# Altium schematic sheet Arduino_DUE_Magic_Pen.SchDoc
size C
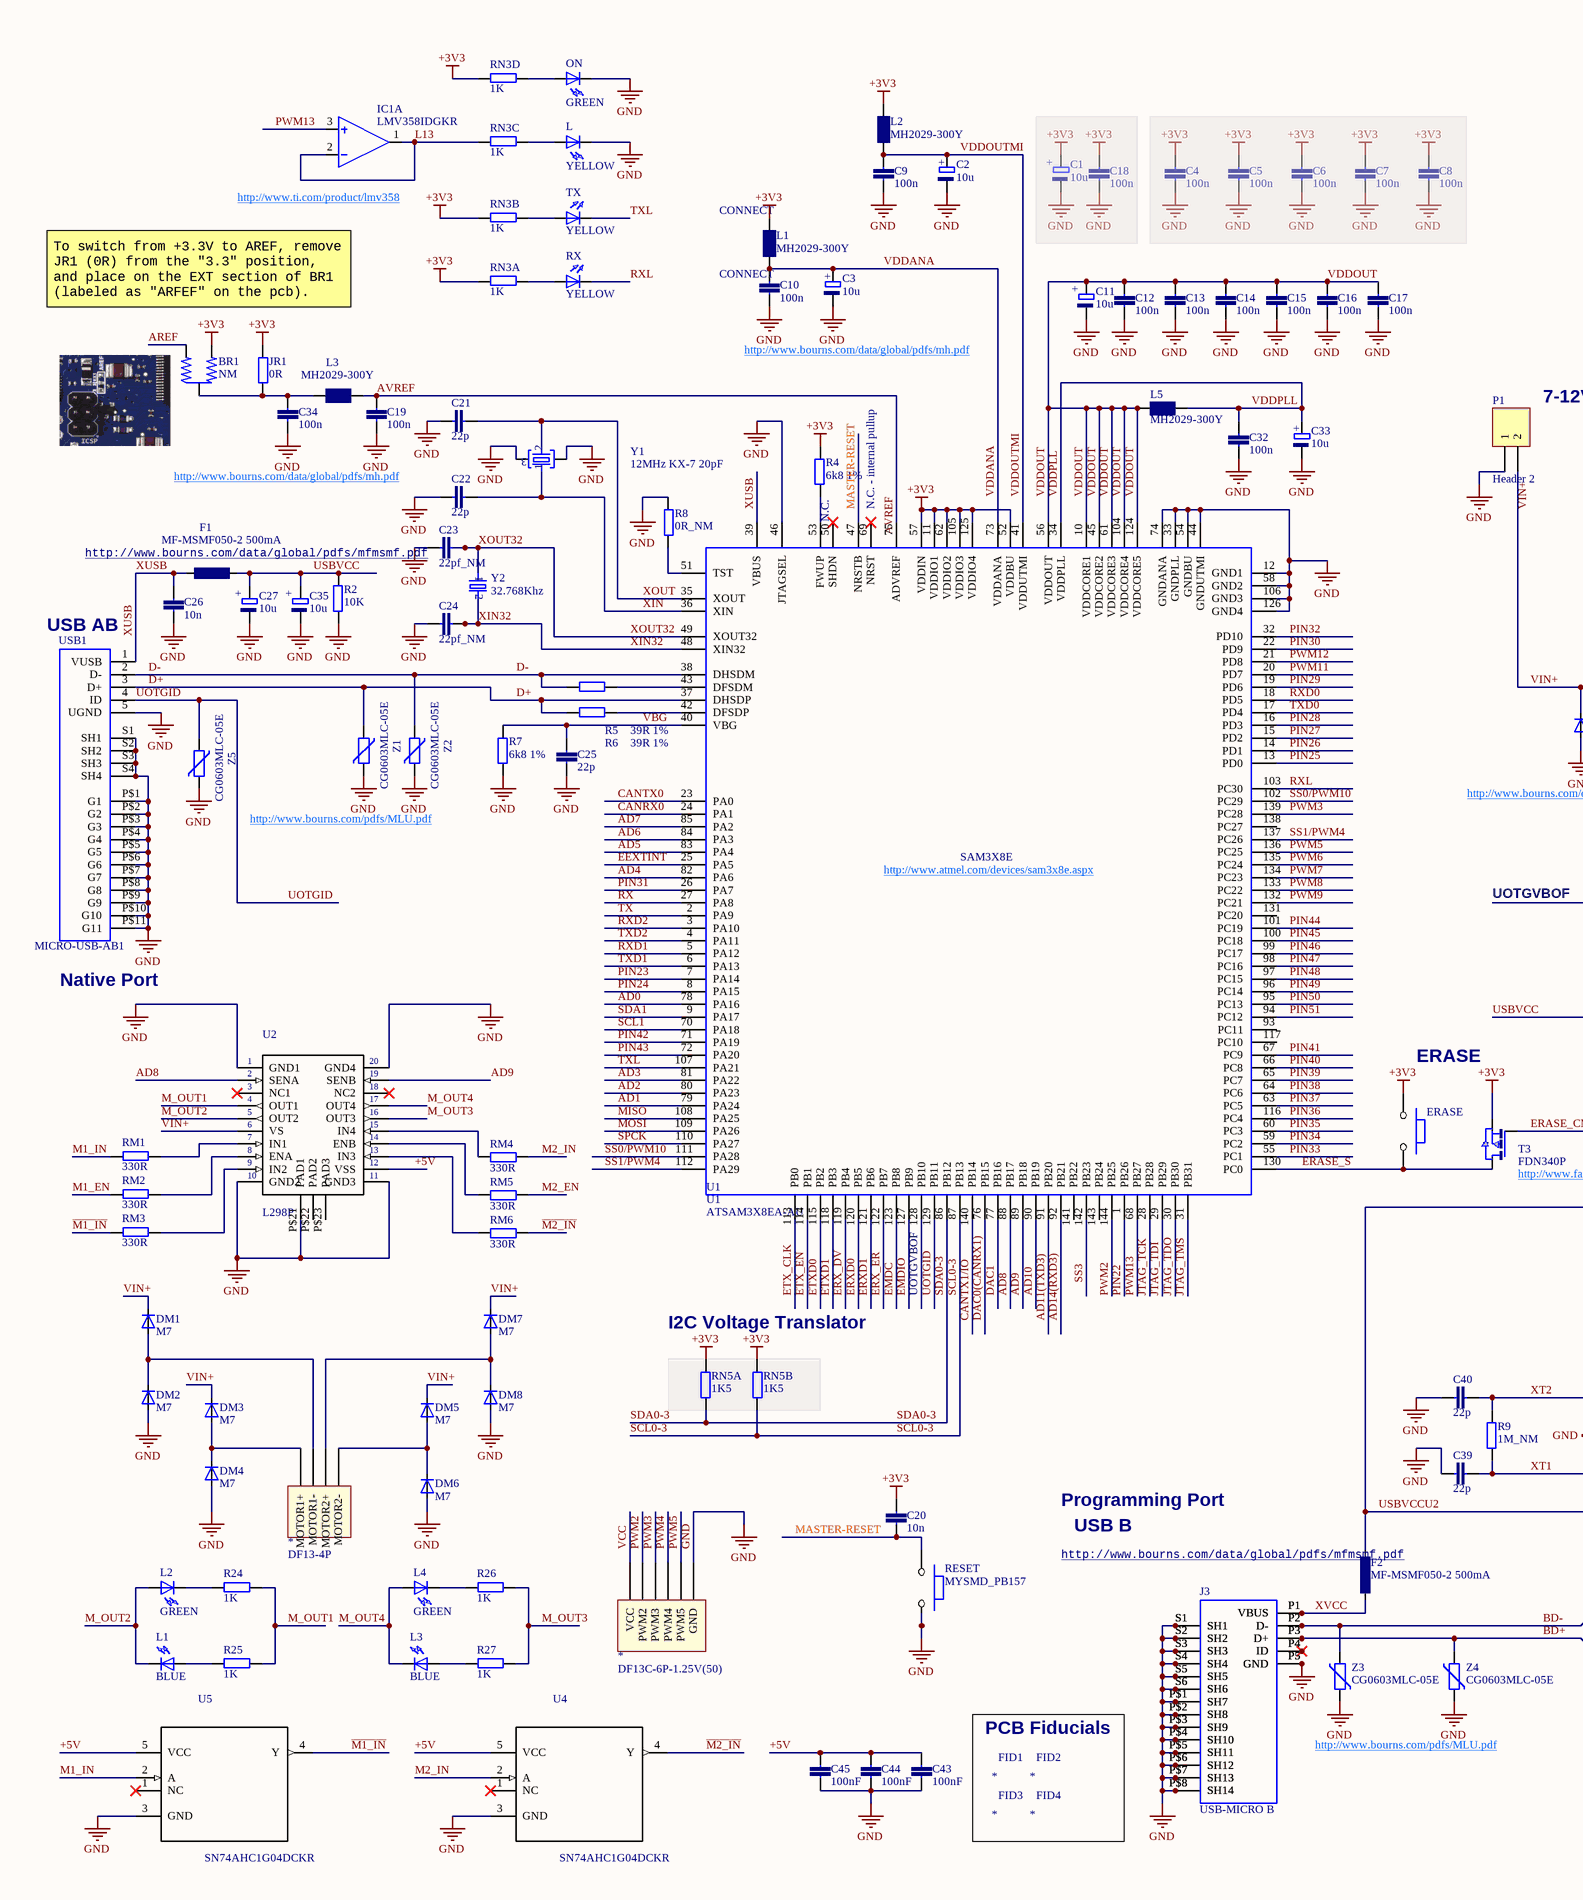
[diagram p0: Arduino_DUE_Magic_Pen.SchDoc, left]
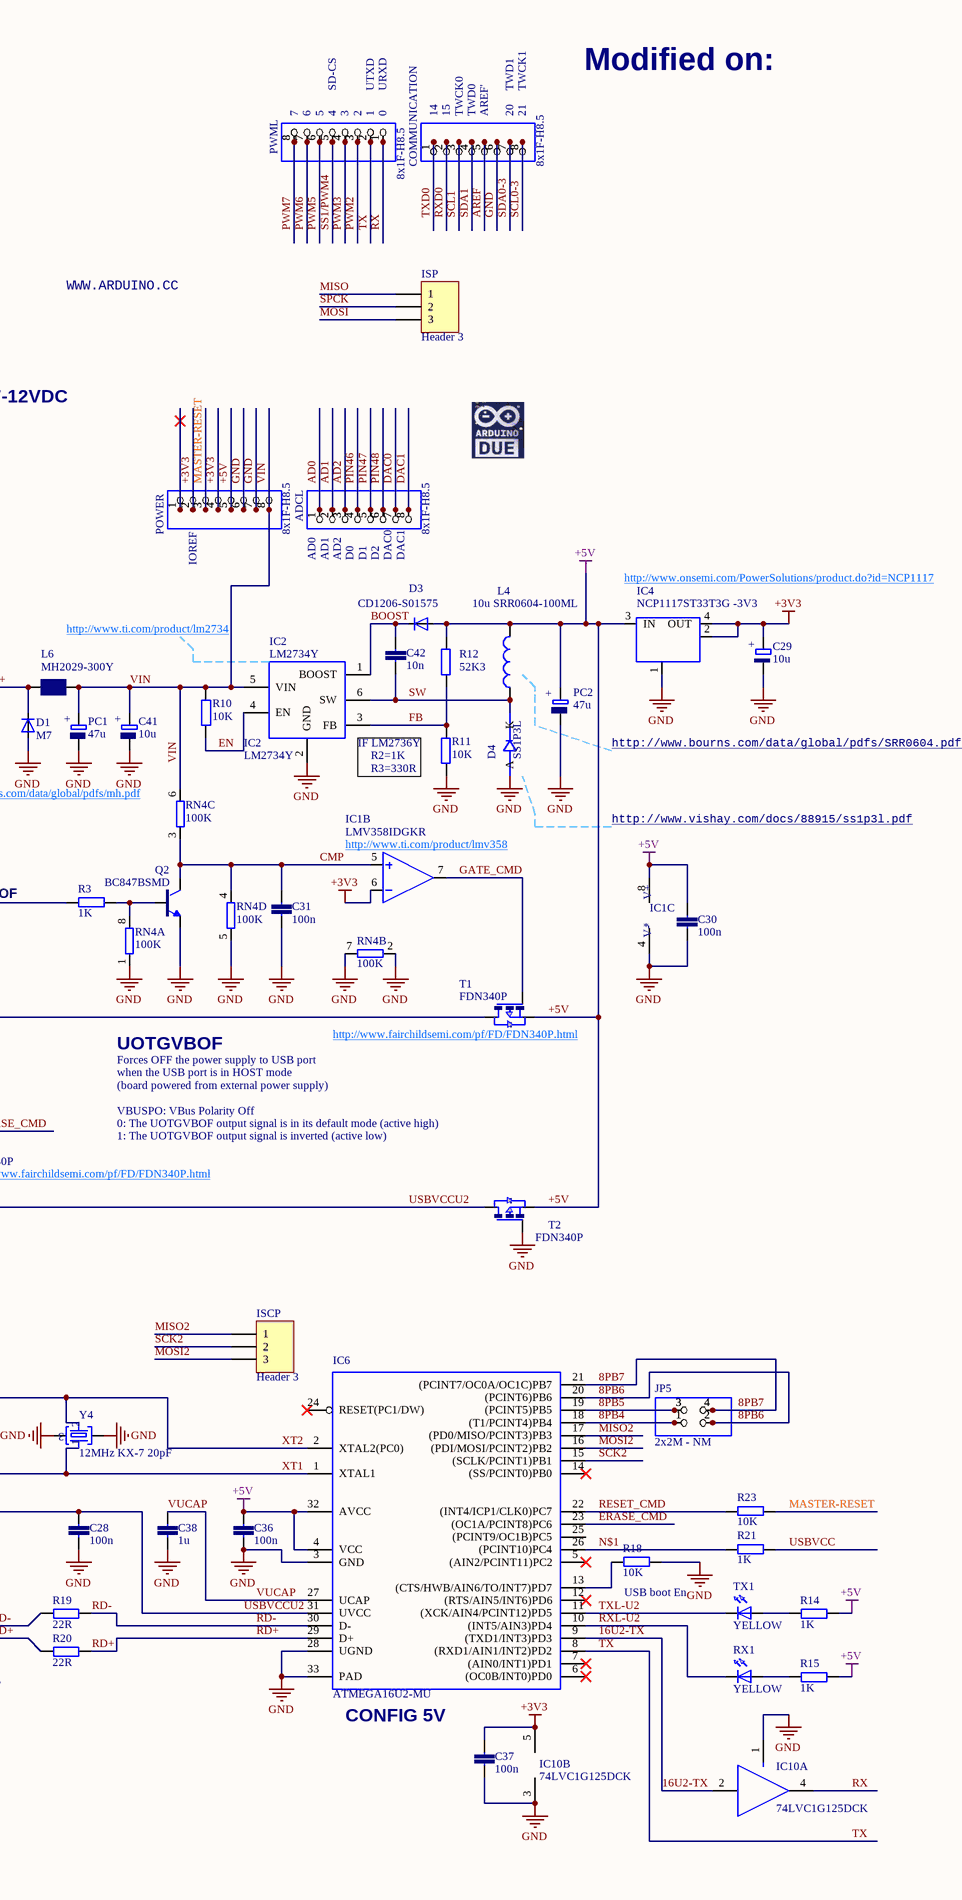
[diagram p1: Arduino_DUE_Magic_Pen.SchDoc, right]

## Parts
(Parts that share a designator on the sheet are numbered #1, #2 ... from top to bottom, then left to right.)
*#1  DF13-4P  [DF13C4P]
*#2  DF13C-6P-1.25V(50)  [DF13C6P]
ADCL  8x1F-H8.5  [1X08]
BR1  NM  [J0402]
C1  10u  [SMC_B]
C2  10u  [SMC_B]
C3  10u  [SMC_B]
C4  100n  [C0603-ROUND]
C5  100n  [C0603-ROUND]
C6  100n  [C0603-ROUND]
C7  100n  [C0603-ROUND]
C8  100n  [C0603-ROUND]
C9  100n  [C0603-ROUND]
C10  100n  [C0603-ROUND]
C11  10u  [SMC_B]
C12  100n  [C0603-ROUND]
C13  100n  [C0603-ROUND]
C14  100n  [C0603-ROUND]
C15  100n  [C0603-ROUND]
C16  100n  [C0603-ROUND]
C17  100n  [C0603-ROUND]
C18  100n  [C0603-ROUND]
C19  100n  [C0603-ROUND]
C20  10n  [C0603-ROUND]
C21  22p  [C0603-ROUND]
C22  22p  [C0603-ROUND]
C23  22pf_NM  [C0603-ROUND]
C24  22pf_NM  [C0603-ROUND]
C25  22p  [C0603-ROUND]
C26  10n  [C0603-ROUND]
C27  10u  [SMC_B]
C28  100n  [C0603-ROUND]
C29  10u  [SMC_B]
C30  100n  [C0603-ROUND]
C31  100n  [C0603-ROUND]
C32  100n  [C0603-ROUND]
C33  10u  [SMC_B]
C34  100n  [C0603-ROUND]
C35  10u  [SMC_B]
C36  100n  [C0603-ROUND]
C37  100n  [C0603-ROUND]
C38  1u  [C0603-ROUND]
C39  22p  [C0603-ROUND]
C40  22p  [C0603-ROUND]
C41  10u  [SMC_B]
C42  10n  [C0603-ROUND]
C43  100nF  [C0603-ROUND]
C44  100nF  [C0603-ROUND]
C45  100nF  [C0603-ROUND]
COMMUNICATION  8x1F-H8.5  [1X08]
D1  M7  [SMB]
D3  CD1206-S01575  [MINIMELF]
D4  SS1P3L  [DO220AAL]  (value not drawn)
DM1  M7  [0603]
DM2  M7  [0603]
DM3  M7  [0603]
DM4  M7  [0603]
DM5  M7  [0603]
DM6  M7  [0603]
DM7  M7  [0603]
DM8  M7  [0603]
ERASE  (no value)  [SMD_157SW]
F1  MF-MSMF050-2 500mA  [L1812]
F2  MF-MSMF050-2 500mA  [L1812]
FID1  *  [FIDUCIA-MOUNT]
FID2  *  [FIDUCIA-MOUNT]
FID3  *  [FIDUCIA-MOUNT]
FID4  *  [FIDUCIA-MOUNT]
IC1  LMV358IDGKR  [MSOP08]  (parts A,B,C of 3)
IC2  LM2734Y  [SOT23-6]
IC4  NCP1117ST33T3G -3V3  [SOT223]
IC6  ATMEGA16U2-MU  [MLF32]
IC10  74LVC1G125DCK  [SC70-5]  (parts A,B of 2)
ISCP  Header 3  [HDR1X3]
ISP  Header 3  [HDR1X3]
J3  USB-MICRO B  [CON2_USB_MICRO_B_AT]
JP5  2x2M - NM  [2X02]
JR1  0R  [R0603-ROUND]
L  YELLOW  [CHIP-LED0805]
L1#1  MH2029-300Y  [0805]
L1#2  BLUE  [CHIP-LED0805]
L2#1  MH2029-300Y  [0805]
L2#2  GREEN  [CHIP-LED0805]
L3#1  MH2029-300Y  [0805]
L3#2  BLUE  [CHIP-LED0805]
L4#1  10u SRR0604-100ML  [SRR0604]
L4#2  GREEN  [CHIP-LED0805]
L5  MH2029-300Y  [0805]
L6  MH2029-300Y  [0805]
ON  GREEN  [CHIP-LED0805]
P1  Header 2  [HDR1X2]
PC1  47u  [PANASONIC_D]
PC2  47u  [PANASONIC_D]
POWER  8x1F-H8.5  [1X08]
PWML  8x1F-H8.5  [1X08]
Q2  BC847BSMD  [SOT23]
R2  10K  [R0603-ROUND]
R3  1K  [R0603-ROUND]
R4  6k8 1%  [R0603-ROUND]
R5  39R 1%  [R0603-ROUND]
R6  39R 1%  [R0603-ROUND]
R7  6k8 1%  [R0603-ROUND]
R8  0R_NM  [R0603-ROUND]
R9  1M_NM  [R0603-ROUND]
R10  10K  [R0603-ROUND]
R11  10K  [R0603-ROUND]
R12  52K3  [R0603-ROUND]
R14  1K  [R0603-ROUND]
R15  1K  [R0603-ROUND]
R18  10K  [R0603-ROUND]
R19  22R  [R0603-ROUND]
R20  22R  [R0603-ROUND]
R21  1K  [R0603-ROUND]
R23  10K  [R0603-ROUND]
R24  1K  [R0603-ROUND]
R25  1K  [R0603-ROUND]
R26  1K  [R0603-ROUND]
R27  1K  [R0603-ROUND]
RESET  MYSMD_PB157  [SMD_157SW]
RM1  330R  [R0603-ROUND]
RM2  330R  [R0603-ROUND]
RM3  330R  [R0603-ROUND]
RM4  330R  [R0603-ROUND]
RM5  330R  [R0603-ROUND]
RM6  330R  [R0603-ROUND]
RN3A  1K  [R0603-ROUND]
RN3B  1K  [R0603-ROUND]
RN3C  1K  [R0603-ROUND]
RN3D  1K  [R0603-ROUND]
RN4  100K  [CAT16]  (parts A,B,C,D of 4)
RN5A  1K5  [R0603-ROUND]
RN5B  1K5  [R0603-ROUND]
RX  YELLOW  [CHIP-LED0805]
RX1  YELLOW  [CHIP-LED0805]
T1  FDN340P  [SOT-23]
T2  FDN340P  [SOT-23]
T3  FDN340P  [SOT-23]
TX  YELLOW  [CHIP-LED0805]
TX1  YELLOW  [CHIP-LED0805]
U1  SAM3X8E  [LQFP144]
U2  L298P  [POWER-SO20_L298P(Primary)]
U4  SN74AHC1G04DCKR  [SOT65P210X110-5N]
U5  SN74AHC1G04DCKR  [SOT65P210X110-5N]
USB1  MICRO-USB-AB1  [MCR-AB1-S-RA-SMT]
Y1  12MHz KX-7 20pF  [CRYSTAL-3.2-2.5]
Y2  32.768Khz  [RESONATOR_EPSON_FC_145]
Y4  12MHz KX-7 20pF  [CRYSTAL-3.2-2.5]
Z1  CG0603MLC-05E  [CT/CN0603]
Z2  CG0603MLC-05E  [CT/CN0603]
Z3  CG0603MLC-05E  [CT/CN0603]
Z4  CG0603MLC-05E  [CT/CN0603]
Z5  CG0603MLC-05E  [CT/CN0603]

## Blocks framed on the sheet
PCB Fiducials: FID1-FID4

## Nets
+3V3: BR1.3 C1.+ C4.2 C5.2 C6.2 C7.2 C8.2 C18.2 C20.2 C29.+ C37.1 ERASE.1 IC1.6(-IN) IC4.2(OUT@1) IC4.4(OUT) IC10.5(VCC) JR1.1 L1#1.1 L2#1.1 POWER.2 POWER.4 R4.2 RN3A.1 RN3B.1 RN3D.1 RN5A.2 RN5B.1 T3.2(S) U1.11(VDDIO1) U1.52(VDDBU) U1.57(VDDIN) U1.62(VDDIO2) U1.105(VDDIO3) U1.125(VDDIO4)
+5V: C30.2 C36.1 C43.1 C44.1 C45.1 D3.A IC1.8(V+) IC4.3(IN) IC6.4(VCC) IC6.32(AVCC) L4#1.P$2 PC2.+ POWER.5 R12.1 R14.1 R15.1 T1.2(S) T2.2(S) U2.P$12(VSS) U4.5(VCC) U5.5(VCC)
GND: *#2.6(GND) C1.- C2.- C3.- C4.1 C5.1 C6.1 C7.1 C8.1 C9.1 C10.1 C11.- C12.1 C13.1 C14.1 C15.1 C16.1 C17.1 C18.1 C19.1 C21.1 C22.1 C23.1 C24.1 C25.2 C26.2 C27.- C28.2 C29.- C30.1 C31.1 C32.1 C33.- C34.1 C35.- C36.2 C37.2 C38.2 C39.1 C40.1 C41.- C43.2 C44.2 C45.2 COMMUNICATION.6 D1.A D4.P$2(A) DM2.A DM4.A DM6.A DM8.A IC1.4(V-) IC2.2(GND) IC4.1(GND/ADJ) IC6.3(GND) IC6.28(UGND) IC6.33(PAD) IC10.1(OE) IC10.3(GND) J3.P5(GND) J3.P$1(SH7) J3.P$2(SH8) J3.P$3(SH9) J3.P$4(SH10) J3.P$5(SH11) J3.P$6(SH12) J3.P$7(SH13) J3.P$8(SH14) J3.S1(SH1) J3.S2(SH2) J3.S3(SH3) J3.S4(SH4) J3.S5(SH5) J3.S6(SH6) L.C ON.C P1.1 PC1.- PC2.- POWER.6 POWER.7 Q2.2(E) R2.2 R7.1 R8.1 R11.2 R18.2 RESET.2 RN4.1 RN4.2 RN4.5 RN4.7 T2.3(G) U1.12(GND1) U1.33(GNDPLL) U1.44(GNDUTMI) U1.46(JTAGSEL) U1.54(GNDBU) U1.58(GND2) U1.74(GNDANA) U1.106(GND3) U1.126(GND4) U2.P$1(GND1) U2.P$10(GND2) U2.P$11(GND3) U2.P$20(GND4) U2.P$21(PAD1) U4.3(GND) U5.3(GND) USB1.5(UGND) USB1.P$1(G1) USB1.P$2(G2) USB1.P$3(G3) USB1.P$4(G4) USB1.P$5(G5) USB1.P$6(G6) USB1.P$7(G7) USB1.P$8(G8) USB1.P$9(G9) USB1.P$10(G10) USB1.P$11(G11) USB1.S1(SH1) USB1.S2(SH2) USB1.S3(SH3) USB1.S4(SH4) Y1.2(GND@1) Y1.4(GND@2) Y4.2(GND@1) Y4.4(GND@2) Z1.2 Z2.2 Z3.1 Z4.1 Z5.1
8PB4: IC6.18((T1/PCINT4)PB4) JP5.1
8PB5: IC6.19((PCINT5)PB5) JP5.3
8PB6: IC6.20((PCINT6)PB6) JP5.2
8PB7: IC6.21((PCINT7/OC0A/OC1C)PB7) JP5.4
16U2-TX: IC6.9((TXD1/INT3)PD3) IC10.2(I)
~{M1_IN}: RM3.1 U5.4(Y)
~{M2_IN}: RM6.1 U4.4(Y)
AD0: ADCL.1 U1.78(PA16)
AD1: ADCL.2 U1.79(PA24)
AD2: ADCL.3 U1.80(PA23)
AD3: U1.81(PA22)
AD4: U1.82(PA6)
AD5: U1.83(PA4)
AD6: U1.84(PA3)
AD7: U1.85(PA2)
AD8: U1.88(PB17) U2.P$2(SENA)
AD9: U1.89(PB18) U2.P$19(SENB)
AD10: U1.90(PB19)
AD11(TXD3): U1.91(PB20)
AD14(RXD3): U1.92(PB21)
AREF: BR1.1 COMMUNICATION.5
AVREF: C19.2 L3#1.2 U1.75(ADVREF)
BD+: J3.P3(D+) R20.2 Z4.2
BD-: J3.P2(D-) R19.2 Z3.2
BOOST: C42.1 D3.C IC2.1(BOOST)
CANRX0: U1.24(PA1)
CANTX0: U1.23(PA0)
CANTX1/IO: U1.140(PB14)
CMP: C31.2 IC1.5(+IN) Q2.3(C) RN4.3 RN4.4
D+: R6.1 U1.37(DHSDP) USB1.3(D+) Z1.1
D-: R5.1 U1.38(DHSDM) USB1.2(D-) Z2.1
DAC0: ADCL.7
DAC0(CANRX1): U1.76(PB15)
DAC1: ADCL.8 U1.77(PB16)
EEXTINT: U1.25(PA5)
EMDC: U1.123(PB8)
EMDIO: U1.127(PB9)
EN: IC2.4(EN) R10.2
ERASE_CMD: IC6.23((OC1A/PCINT8)PC6) T3.3(G)
ERASE_S: ERASE.2 T3.1(D) U1.130(PC0)
ERX_DV: U1.119(PB4)
ERX_ER: U1.122(PB7)
ERXD0: U1.120(PB5)
ERXD1: U1.121(PB6)
ETX_CLK: U1.113(PB0)
ETX_EN: U1.114(PB1)
ETXD0: U1.115(PB2)
ETXD1: U1.118(PB3)
FB: IC2.3(FB) R11.1 R12.2
GATE_CMD: IC1.7(OUT) T1.3(G)
JTAG_TCK: U1.28(PB28)
JTAG_TDI: U1.29(PB29)
JTAG_TDO: U1.30(PB30)
JTAG_TMS: U1.31(PB31)
L13: IC1.1(OUT) IC1.2(-IN) RN3C.1
M1_EN: RM2.1
M1_IN: RM1.1 U5.2(A)
M2_EN: RM5.1
M2_IN: RM4.1 U4.2(A)
M_OUT1: R24.2 R25.2 U2.P$4(OUT1)
M_OUT2: L1#2.C L2#2.A U2.P$5(OUT2)
M_OUT3: R26.2 R27.2 U2.P$16(OUT3)
M_OUT4: L3#2.C L4#2.A U2.P$17(OUT4)
MASTER-RESET: C20.1 POWER.3 R23.2 RESET.1 U1.47(NRSTB)
MISO: ISP.1 U1.108(PA25)
MISO2: IC6.17((PD0/MISO/PCINT3)PB3) ISCP.1
MOSI: ISP.3 U1.109(PA26)
MOSI2: IC6.16((PDI/MOSI/PCINT2)PB2) ISCP.3
N$1: IC6.26((PCINT10)PC4) R21.1
PIN22: U1.1(PB26)
PIN23: U1.7(PA14)
PIN24: U1.8(PA15)
PIN25: U1.13(PD0)
PIN26: U1.14(PD1)
PIN27: U1.15(PD2)
PIN28: U1.16(PD3)
PIN29: U1.19(PD6)
PIN30: U1.22(PD9)
PIN31: U1.26(PA7)
PIN32: U1.32(PD10)
PIN33: U1.55(PC1)
PIN34: U1.59(PC2)
PIN35: U1.60(PC3)
PIN36: U1.116(PC4)
PIN37: U1.63(PC5)
PIN38: U1.64(PC6)
PIN39: U1.65(PC7)
PIN40: U1.66(PC8)
PIN41: U1.67(PC9)
PIN42: U1.71(PA19)
PIN43: U1.72(PA20)
PIN44: U1.101(PC19)
PIN45: U1.100(PC18)
PIN46: ADCL.4 U1.99(PC17)
PIN47: ADCL.5 U1.98(PC16)
PIN48: ADCL.6 U1.97(PC15)
PIN49: U1.96(PC14)
PIN50: U1.95(PC13)
PIN51: U1.94(PC12)
PWM2: *#2.2(PWM2) PWML.3 U1.144(PB25)
PWM3: *#2.3(PWM3) PWML.4 U1.139(PC28)
PWM4: *#2.4(PWM4)
PWM5: *#2.5(PWM5) PWML.6 U1.136(PC25)
PWM6: PWML.7 U1.135(PC24)
PWM7: PWML.8 U1.134(PC23)
PWM8: U1.133(PC22)
PWM9: U1.132(PC21)
PWM11: U1.20(PD7)
PWM12: U1.21(PD8)
PWM13: IC1.3(+IN) U1.68(PB27)
RD+: IC6.29(D+) R20.1
RD-: IC6.30(D-) R19.1
RESET_CMD: IC6.22((INT4/ICP1/CLK0)PC7) R23.1
RX: IC10.4(O) PWML.1 U1.27(PA8)
RXD0: COMMUNICATION.2 U1.18(PD5)
RXD1: U1.5(PA12)
RXD2: U1.3(PA10)
RXL: RX.C U1.103(PC30)
RXL-U2: IC6.10((INT5/AIN3)PD4) RX1.C
SCK2: IC6.15((SCLK/PCINT1)PB1) ISCP.2
SCL0-3: COMMUNICATION.8 RN5B.2 U1.87(PB13)
SCL1: COMMUNICATION.3 U1.70(PA18)
SDA0-3: COMMUNICATION.7 RN5A.1 U1.86(PB12)
SDA1: COMMUNICATION.4 U1.9(PA17)
SPCK: ISP.2 U1.110(PA27)
SS0/PWM10: U1.102(PC29) U1.111(PA28)
SS1/PWM4: PWML.5 U1.112(PA29) U1.137(PC26)
SS3: U1.142(PB23)
SW: C42.2 D4.P$1(K) IC2.6(SW) L4#1.P$1
TX: IC6.8((RXD1/AIN1/INT2)PD2) PWML.2 U1.2(PA9)
TXD0: COMMUNICATION.1 U1.17(PD4)
TXD1: U1.6(PA13)
TXD2: U1.4(PA11)
TXL: TX.C U1.107(PA21)
TXL-U2: IC6.11((XCK/AIN4/PCINT12)PD5) TX1.C
UOTGID: U1.129(PB11) USB1.4(ID) Z5.2
UOTGVBOF: R3.1 U1.128(PB10)
USBVCC: C27.+ C35.+ F1.1 R2.1 R21.2 T1.1(D)
USBVCCU2: C28.1 F2.1 IC6.31(UVCC) T2.1(D)
VBG: C25.1 R7.2 U1.40(VBG)
VCC: *#2.1(VCC)
VDDANA: C3.+ C10.2 L1#1.2 U1.73(VDDANA)
VDDOUT: C11.+ C12.2 C13.2 C14.2 C15.2 C16.2 C17.2 L5.1 U1.10(VDDCORE1) U1.45(VDDCORE2) U1.56(VDDOUT) U1.61(VDDCORE3) U1.104(VDDCORE4) U1.124(VDDCORE5)
VDDOUTMI: C2.+ C9.2 L2#1.2 U1.41(VDDUTMI)
VDDPLL: C32.2 C33.+ L5.2 U1.34(VDDPLL)
VIN: C41.+ IC2.5(VIN) L6.1 PC1.+ POWER.8 R10.1 RN4.6
VIN+: D1.C DM1.C DM3.C DM5.C DM7.C L6.2 P1.2 U2.P$6(VS)
VUCAP: C38.1 IC6.27(UCAP)
XIN: C22.2 U1.36(XIN) Y1.1(C1)
XIN32: C24.2 U1.48(XIN32) Y2.P$2
XOUT: C21.2 U1.35(XOUT) Y1.3(C2)
XOUT32: C23.2 U1.49(XOUT32) Y2.P$1
XT1: C39.2 IC6.1(XTAL1) R9.1 Y4.1(C1)
XT2: C40.2 IC6.2(XTAL2(PC0)) R9.2 Y4.3(C2)
XUSB: C26.1 F1.2 U1.39(VBUS) USB1.1(VUSB)
XVCC: F2.2 J3.P1(VBUS)
Net*#1_1: *#1.1(MOTOR1+) DM3.A DM4.C
Net*#1_2: *#1.2(MOTOR1-) DM1.A DM2.C
Net*#1_3: *#1.3(MOTOR2+) DM7.A DM8.C
Net*#1_4: *#1.4(MOTOR2-) DM5.A DM6.C
NetBR1_2: BR1.2(C) C34.2 JR1.2 L3#1.1
NetIC6_13: IC6.13((CTS/HWB/AIN6/TO/INT7)PD7) R18.1
NetL1#2_A: L1#2.A R25.1
NetL2#2_C: L2#2.C R24.1
NetL3#2_A: L3#2.A R27.1
NetL4#2_C: L4#2.C R26.1
NetL_A: L.A RN3C.2
NetON_A: ON.A RN3D.2
NetQ2_1: Q2.1(B) R3.2 RN4.8
NetR4_1: R4.1 U1.53(FWUP)
NetR5_2: R5.2 U1.43(DFSDM)
NetR6_2: R6.2 U1.42(DFSDP)
NetR8_2: R8.2 U1.51(TST)
NetR14_2: R14.2 TX1.A
NetR15_2: R15.2 RX1.A
NetRM1_2: RM1.2 U2.P$7(IN1)
NetRM2_2: RM2.2 U2.P$8(ENA)
NetRM3_2: RM3.2 U2.P$9(IN2)
NetRM4_2: RM4.2 U2.P$15(IN4)
NetRM5_2: RM5.2 U2.P$14(ENB)
NetRM6_2: RM6.2 U2.P$13(IN3)
NetRN3A_2: RN3A.2 RX.A
NetRN3B_2: RN3B.2 TX.A

Not connected (* = marked no-connect by the designer): IC6 5((AIN2/PCINT11)PC2)* 6((OC0B/INT0)PD0)* 7((AIN0/INT1)PD1)* 12((RTS/AIN5/INT6)PD6)* 14((SS/PCINT0)PB0)* 24(RESET(PC1/DW))* 25((PCINT9/OC1B)PC5); J3 P4(ID)*; POWER 1*; U1 50(SHDN)* 69(NRST)* 93(PC11) 117(PC10) 131(PC20) 138(PC27) 141(PB22) 143(PB24); U2 P$3(NC1)* P$18(NC2)* P$22(PAD2) P$23(PAD3); U4 1(NC)*; U5 1(NC)*

## Notes on the sheet
- (near PWML) SD-CS
- (near PWML) UTXD
- (near PWML) URXD
- TWD1
- TWCK1
- Modified on:
- (near PWML) 7
- (near PWML) 6
- (near PWML) 5
- (near PWML) 4
- (near PWML) 3
- (near PWML) 2
- (near PWML) 1
- (near PWML) 0
- 14
- 15
- (near COMMUNICATION) TWCK0
- (near COMMUNICATION) TWD0
- (near COMMUNICATION) AREF'
- (near COMMUNICATION) 20
- (near COMMUNICATION) 21
- (near IC1) http://www.ti.com/product/lmv358
- CONNECT
- To switch from +3.3V to AREF, remove JR1 (0R) from the "3.3" position,  and place on the EXT section of BR1 (labeled as "ARFEF" on the pcb).
- WWW.ARDUINO.CC
- http://www.bourns.com/data/global/pdfs/mh.pdf
- (near P1) 7-12VDC
- (near C22) http://www.bourns.com/data/global/pdfs/mh.pdf
- N.C.
- N.C. - internal pullup
- (near F1) http://www.bourns.com/data/global/pdfs/mfmsmf.pdf
- (near POWER) IOREF
- (near ADCL) AD0
- (near ADCL) AD1
- (near ADCL) AD2
- (near ADCL) D0
- (near ADCL) D1
- (near ADCL) D2
- (near ADCL) DAC0
- (near ADCL) DAC1
- (near IC4) http://www.onsemi.com/PowerSolutions/product.do?id=NCP1117
- (near USB1) USB AB
- http://www.ti.com/product/lm2734
- (near IC2) IF LM2736Y
- (near IC2) R2=1K
- R3=330R
- http://www.bourns.com/data/global/pdfs/SRR0604.pdf
- http://www.bourns.com/pdfs/MLU.pdf
- (near RN4) http://www.bourns.com/data/global/pdfs/mh.pdf
- http://www.vishay.com/docs/88915/ss1p3l.pdf
- (near U1) http://www.atmel.com/devices/sam3x8e.aspx
- (near USB1) Native Port
- (near T1) http://www.fairchildsemi.com/pf/FD/FDN340P.html
- ERASE
- Forces OFF the power supply to USB port
- when the USB port is in HOST mode
- (board powered from external power supply)
- UOTGVBOF
- VBUSPO: VBus Polarity Off
- 0: The UOTGVBOF output signal is in its default mode (active high)
- 1: The UOTGVBOF output signal is inverted (active low)
- (near T3) http://www.fairchildsemi.com/pf/FD/FDN340P.html
- I2C Voltage Translator
- Programming Port
- USB B
- (near F2) http://www.bourns.com/data/global/pdfs/mfmsmf.pdf
- (near R18) USB boot En
- (near IC6) CONFIG 5V
- Labels drawn without touching a wire or pin: AVREF, VIN+
- (in symbol ATSAM3X/AAU) ATSAM3X8EA-AU
- (in symbol L298P) 1; 20; 2; 19; 3; 18; 4; 17; 5; 16; 6; 15; 7; 14; 8; 13; 9; 12; 10; 11

## Library data of the parts
*#1 = DF13-4P-1.25H: CONN SM DF13 4P RA 1.25H
*#2 = DF13C-6P-1.25V(50): CONN SM DF13C 6P
ADCL COMMUNICATION POWER PWML = PINHD-1X8
BR1 = J0402
C1-C3 C11 C27 C29 C33 C35 C41 = CPOL-EUSMCB
C4-C10 C12-C26 C28 C30-C32 C34 C36-C40 C42-C45 = C-EUC0603
D1 DM1-DM8 = DIODE-SMB
D3 = DIODE-MINIMELF
ERASE = MYSMD_PB157
F1 F2 = L-EUL1812
FID1-FID4 = FIDUCIALMOUNT
IC1 = LMV358MMX
IC2 = LM2736Y
IC4 = MC33269ST-3.3T3
ISCP ISP = Header 3: Header, 3-Pin; LatestRevisionDate: 17-Jul-2002; LatestRevisionNote: Re-released for DXP Platform.; Publisher: Altium Limited
J3 = MYCON2_USB-MINI-B
JP5 = PINHD-2X2
JR1 R2-R10 R14 R15 R18-R21 R23-R27 RM1-RM6 RN3A RN3B RN3C RN3D RN5A RN5B = R-EU_R0603
L L1#2 L2#2 L3#2 L4#2 ON RX RX1 TX TX1 = LEDCHIP-LED0805
L1#1 L2#1 L3#1 L5 L6 = WE-CBF_0805
L4#1 = L-USSRR0604
P1 = Header 2: Header, 2-Pin; LatestRevisionDate: 17-Jul-2002; LatestRevisionNote: Re-released for DXP Platform.; Publisher: Altium Limited
PC1 PC2 = CPOL-EUD
R11 R12 = R-EU_0603-RND
RN4 = 4R-NCAT16
T1-T3 = PMOSSOT23
U1 = ATSAM3X/AAU
U2 = L298P: IC BRIDGE DRIVER PAR 20POWERSO; MF: STMicroelectronics; Availability: Good; Price: 4.64 USD; Package: SO-20 STMicroelectronics; MP: L298P; Value: *
U4 U5 = SN74AHC1G04DCKR: IC SINGLE INVERTER GATE SC70-5; MF: Texas Instruments; Availability: Good; MP: SN74AHC1G04DCKR; Price: 0.11 USD; Package: SC-70-5 Texas Instruments; Value: *
USB1 = MICRO_USB
Y1 Y4 = CRYSTAL-3.2-2.5
Y2 = RESONATOR_EPSON_FC_145
Z1-Z5 = VARISTORCN0603